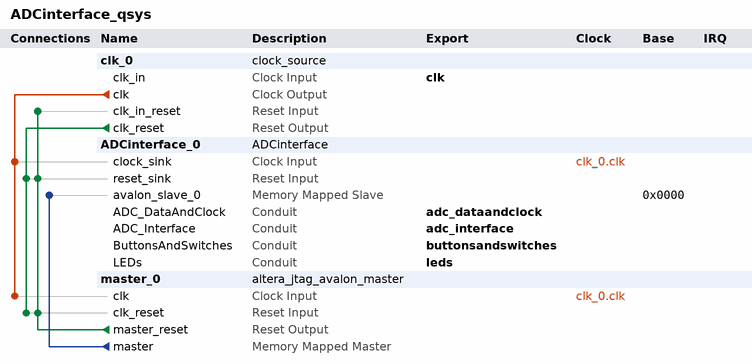
[diagram p0: system contents]
# Platform Designer (Qsys) system ADCinterface_qsys, Cyclone V 5CEFA2F23C8
# Parameters at their usual value, and those the tool derives, are not listed.
package require -exact qsys 14.1
create_system ADCinterface_qsys
set_project_property DEVICE_FAMILY {Cyclone V}
set_project_property DEVICE 5CEFA2F23C8

add_instance clk_0 clock_source 14.1
set_instance_parameter_value clk_0 clockFrequency 50000000

add_instance ADCinterface_0 ADCinterface 1.0

add_instance master_0 altera_jtag_avalon_master 14.1

# connections
add_connection clk_0.clk ADCinterface_0.clock_sink clock
add_connection clk_0.clk master_0.clk clock
add_connection clk_0.clk_reset ADCinterface_0.reset_sink reset
add_connection clk_0.clk_reset master_0.clk_reset reset
add_connection master_0.master_reset ADCinterface_0.reset_sink reset
add_connection master_0.master_reset clk_0.clk_in_reset reset
add_connection master_0.master_reset master_0.clk_reset reset
add_connection master_0.master ADCinterface_0.avalon_slave_0 avalon
set_connection_parameter_value master_0.master/ADCinterface_0.avalon_slave_0 baseAddress 0x0000

# exported interfaces
add_interface adc_dataandclock conduit end
set_interface_property adc_dataandclock EXPORT_OF ADCinterface_0.ADC_DataAndClock
add_interface adc_interface conduit end
set_interface_property adc_interface EXPORT_OF ADCinterface_0.ADC_Interface
add_interface buttonsandswitches conduit end
set_interface_property buttonsandswitches EXPORT_OF ADCinterface_0.ButtonsAndSwitches
add_interface clk clock sink
set_interface_property clk EXPORT_OF clk_0.clk_in
add_interface leds conduit end
set_interface_property leds EXPORT_OF ADCinterface_0.LEDs

set_interconnect_requirement {$system} qsys_mm.clockCrossingAdapter HANDSHAKE
set_interconnect_requirement {$system} qsys_mm.insertDefaultSlave FALSE
set_interconnect_requirement {$system} qsys_mm.maxAdditionalLatency 1

save_system ADCinterface_qsys.qsys
